# EAGLE design board (EAGLE 9.6.2)
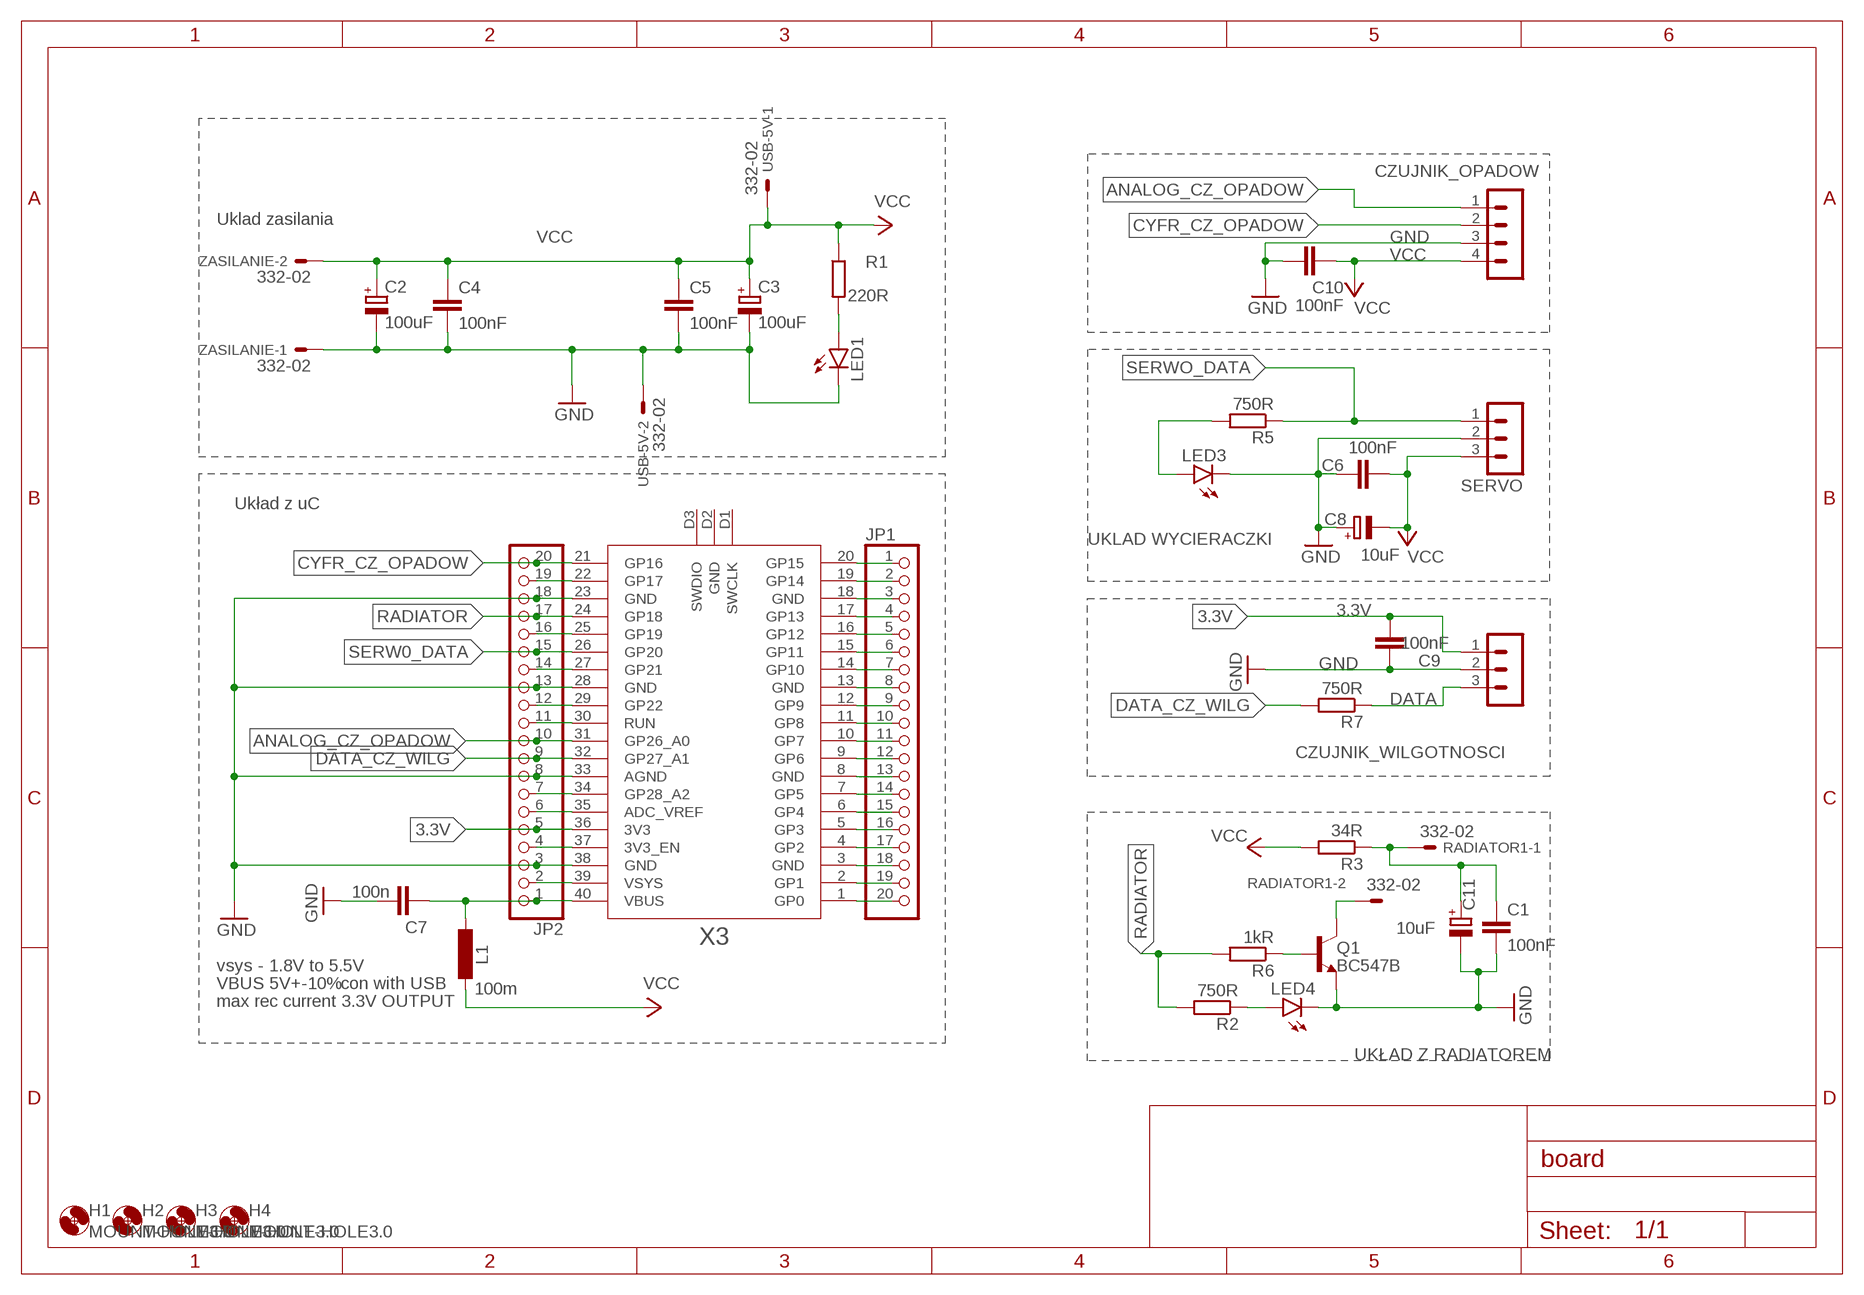
[diagram p0: schematic, sheet 1]

## Parts
C1  100nF  C-EUC0805  [C0805]
C2  100uF  CPOL-EUUD-5X5,8  [UD-5X5,8_NICHICON]
C3  100uF  CPOL-EUUD-5X5,8  [UD-5X5,8_NICHICON]
C4  100nF  C-EUC0805  [C0805]
C5  100nF  C-EUC0805  [C0805]
C6  100nF  C-EUC0805  [C0805]
C7  100n  C-EUC0603  [C0603]
C8  10uF  CPOL-EUE5-8.5  [E5-8,5]
C9  100nF  C-EUC0805  [C0805]
C10  100nF  C-EUC0805  [C0805]
C11  10uF  CPOL-EUE5-8.5  [E5-8,5]
CZUJNIK_OPADOW  MA04-1  [MA04-1]
CZUJNIK_WILGOTNOSCI  MA03-1  [MA03-1]
H1  MOUNT-HOLE3.0  [3,0]
H2  MOUNT-HOLE3.0  [3,0]
H3  MOUNT-HOLE3.0  [3,0]
H4  MOUNT-HOLE3.0  [3,0]
JP1  PINHD-1X20  [1X20]
JP2  PINHD-1X20  [1X20]
L1  100m  L-EUL2012C  [L2012C]
LED1  LEDSML0805  [SML0805]
LED3  LEDSML0805  [SML0805]
LED4  LEDSML0805  [SML0805]
Q1  BC547B  [TO92]
R1  220R  R-EU_R0805  [R0805]
R2  750R  R-EU_R0805  [R0805]
R3  34R  R-EU_R0805  [R0805]
R5  750R  R-EU_R0805  [R0805]
R6  1kR  R-EU_R0805  [R0805]
R7  750R  R-EU_R0805  [R0805]
RADIATOR1  332-02  [332-02]
SERVO  MA03-1  [MA03-1]
USB-5V  332-02  [332-02]
X3  RPI_PICO_IG-TH  [RPI_PICO_TH]
ZASILANIE  332-02  [332-02]

## Nets
3.3V: C9.2 CZUJNIK_WILGOTNOSCI.1 JP2.5 X3.36(3V3)
ANALOG_CZ_OPADOW: CZUJNIK_OPADOW.1 JP2.10 X3.31(GP26_A0)
CYFR_CZ_OPADOW: CZUJNIK_OPADOW.2 JP2.20 X3.21(GP16)
DATA: CZUJNIK_WILGOTNOSCI.3 R7.1
DATA_CZ_WILG: JP2.9 R7.2 X3.32(GP27_A1)
GND: C1.2 C2.- C3.- C4.2 C5.2 C6.1 C7.2 C8.+ C9.1 C10.2 C11.- CZUJNIK_OPADOW.3 CZUJNIK_WILGOTNOSCI.2 JP2.3 JP2.8 JP2.13 JP2.18 LED1.C LED3.C LED4.C Q1.1(E) SERVO.2 USB-5V.2 X3.23(GND) X3.28(GND) X3.33(AGND) X3.38(GND) ZASILANIE.1
N$1: JP2.19 X3.22(GP17)
N$2: LED1.A R1.2
N$3: Q1.3(C) RADIATOR1.2
N$4: Q1.2(B) R6.1
N$5: C7.1 JP2.1 L1.2 X3.40(VBUS)
N$6: LED4.A R2.1
N$7: JP2.16 X3.25(GP19)
N$8: LED3.A R5.2
N$9: R5.1 SERVO.1
N$10: JP1.1 X3.20(GP15)
N$11: JP2.14 X3.27(GP21)
N$12: JP2.12 X3.29(GP22)
N$13: JP2.11 X3.30(RUN)
N$14: JP2.7 X3.34(GP28_A2)
N$15: JP2.6 X3.35(ADC_VREF)
N$16: JP2.4 X3.37(3V3_EN)
N$18: JP1.20 X3.1(GP0)
N$19: JP1.19 X3.2(GP1)
N$20: JP1.18 X3.3(GND)
N$21: JP1.17 X3.4(GP2)
N$22: JP1.16 X3.5(GP3)
N$23: JP1.15 X3.6(GP4)
N$24: JP1.14 X3.7(GP5)
N$25: JP1.13 X3.8(GND)
N$26: JP1.12 X3.9(GP6)
N$27: JP1.11 X3.10(GP7)
N$28: JP1.10 X3.11(GP8)
N$29: JP1.9 X3.12(GP9)
N$30: JP1.8 X3.13(GND)
N$31: JP1.7 X3.14(GP10)
N$32: JP1.6 X3.15(GP11)
N$33: JP1.5 X3.16(GP12)
N$34: JP1.4 X3.17(GP13)
N$35: JP1.3 X3.18(GND)
N$36: JP1.2 X3.19(GP14)
N$37: JP2.2 X3.39(VSYS)
RADIATOR: JP2.17 R2.2 R6.2 X3.24(GP18)
SERW0_DATA: JP2.15 X3.26(GP20)
VCC: C2.+ C3.+ C4.1 C5.1 C6.2 C8.- C10.1 CZUJNIK_OPADOW.4 L1.1 R1.1 R3.2 SERVO.3 USB-5V.1 ZASILANIE.2
VCC1: C1.1 C11.+ R3.1 RADIATOR1.1
Unconnected: X3.D1(SWCLK) X3.D2(GND) X3.D3(SWDIO)

## Notes on the sheet
- Uklad zasilania
- Układ z uC
- UKLAD WYCIERACZKI
- vsys - 1.8V to 5.5V
- VBUS 5V+-10% | con with USB
- max rec current 3.3V OUTPUT
- UKŁAD Z RADIATOREM

## Library data of the parts
C1 C4-C7 C9 C10 = rcl:C-EU: CAPACITOR, European symbol; SPICEPREFIX: C
C2 C3 C8 C11 = rcl:CPOL-EU: POLARIZED CAPACITOR, European symbol; SPICEPREFIX: C
CZUJNIK_OPADOW = con-lstb:MA04-1: PIN HEADER; OC_FARNELL: unknown; OC_NEWARK: unknown
CZUJNIK_WILGOTNOSCI SERVO = con-lstb:MA03-1: PIN HEADER; OC_FARNELL: unknown; OC_NEWARK: unknown
H1-H4 = holes:MOUNT-HOLE: MOUNTING HOLE with drill center marker
JP1 JP2 = pinhead:PINHD-1X20: PIN HEADER
L1 = rcl:L-EU: INDUCTOR, European symbol; SPICEPREFIX: L
LED1 LED3 LED4 = led:LED: LED OSRAM: - CHIPLED LG R971, LG N971, LY N971, LG Q971, LY Q971, LO R971, LY R971 LH N974, LH R974 LS Q976, LO Q976, LY Q976 LO Q996 - Hyper CHIPLED LW Q18S LB Q993, LB Q99A, LB R99A - SideLED LS A670, LO A670, LY A670, LG A670, LP A670 LB A673, LV A673, LT A673, LW A673 LH A674 LY A675 LS A676, LA A676, LO A676, LY A676, LW A676 LS A679, LY A679, LG A679 - Hyper Micro SIDELED® LS Y876, LA Y876, LO Y876, LY Y876 LT Y87S - SmartLED LW L88C, LW L88S LB L89C, LB L89S, LG L890 LS L89K, LO L89K, LY L89K LS L896, LA L896, LO L896, LY L896 - TOPLED LS T670, LO T670, LY T670, LG T670, LP T670 LSG T670, LSP T670, LSY T670, LOP T670, LYG T670 LG T671, LOG T671, LSG T671 LB T673, LV T673, LT T673, LW T673 LH T674 LS T676, LA T676, LO T676, LY T676, LB T676, LH T676, LSB T676, LW T676 LB T67C, LV T67C, LT T67C, LS T67K, LO T67K, LY T67K, LW E67C LS E67B, LA E67B, LO E67B, LY E67B, LB E67C, LV E67C, LT E67C LW T67C LS T679, LY T679, LG T679 LS T770, LO T770, LY T770, LG T770, LP T770 LB T773, LV T773, LT T773, LW T773 LH T774 LS E675, LA E675, LY E675, LS T675 LS T776, LA T776, LO T776, LY T776, LB T776 LHGB T686 LT T68C, LB T68C - Hyper Mini TOPLED® LB M676 - Mini TOPLED Santana® LG M470 LS M47K, LO M47K, LY M47K Source: http://www.osram.convergy.de LUXEON: - LUMILED® LXK2-PW12-R00, LXK2-PW12-S00, LXK2-PW14-U00, LXK2-PW14-V00 LXK2-PM12-R00, LXK2-PM12-S00, LXK2-PM14-U00 LXK2-PE12-Q00, LXK2-PE12-R00, LXK2-PE12-S00, LXK2-PE14-T00, LXK2-PE14-U00 LXK2-PB12-K00, LXK2-PB12-L00, LXK2-PB12-M00, LXK2-PB14-N00, LXK2-PB14-P00, LXK2-PB14-Q00 LXK2-PR12-L00, LXK2-PR12-M00, LXK2-PR14-Q00, LXK2-PR14-R00 LXK2-PD12-Q00, LXK2-PD12-R00, LXK2-PD12-S00 LXK2-PH12-R00, LXK2-PH12-S00 LXK2-PL12-P00, LXK2-PL12-Q00, LXK2-PL12-R00 Source: www.luxeon.com KINGBRIGHT: KA-3528ASYC Source: www.kingbright.com
Q1 = transistor-npn:BC547*: NPN Transistor
R1-R3 R5-R7 = rcl:R-EU_: RESISTOR, European symbol; SPICEPREFIX: R
RADIATOR1 USB-5V ZASILANIE = con-garry:332-02: 2 Pin - 2mm Dual Row Source: www.mpe-connector.de / garry_shortform_2012.pdf
X3 = RaspberryPi_Pico-corr:RPI_PICO_IG

## Board
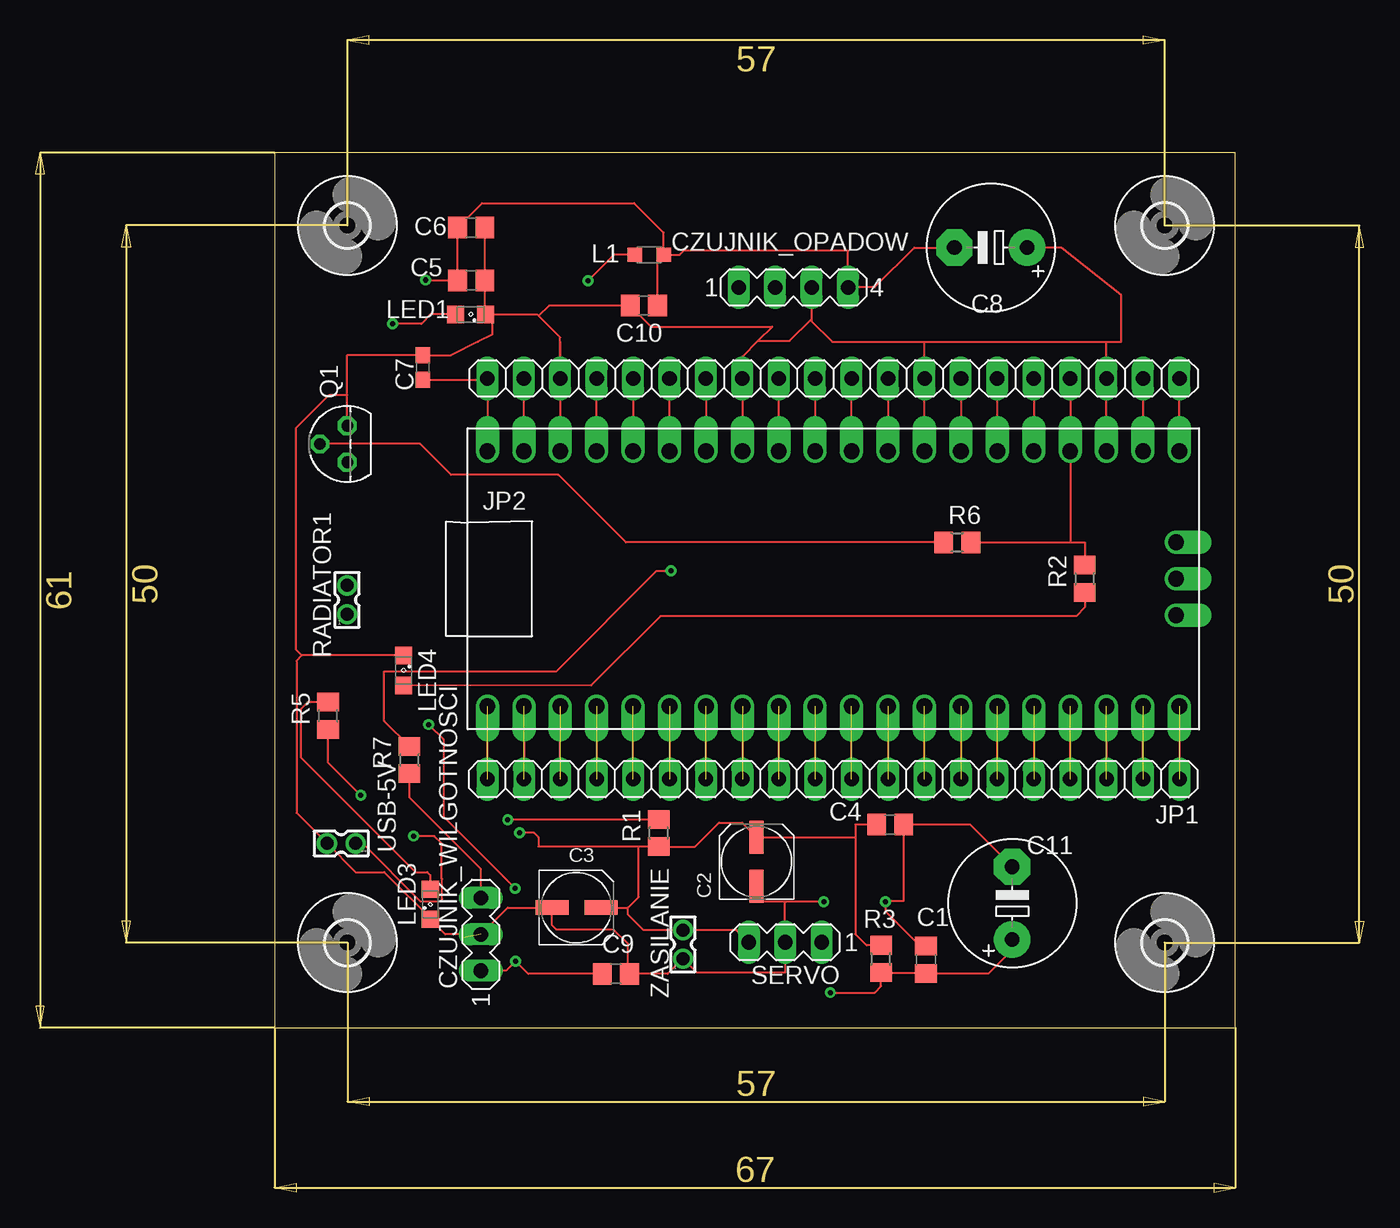
[diagram p1: board, top side]
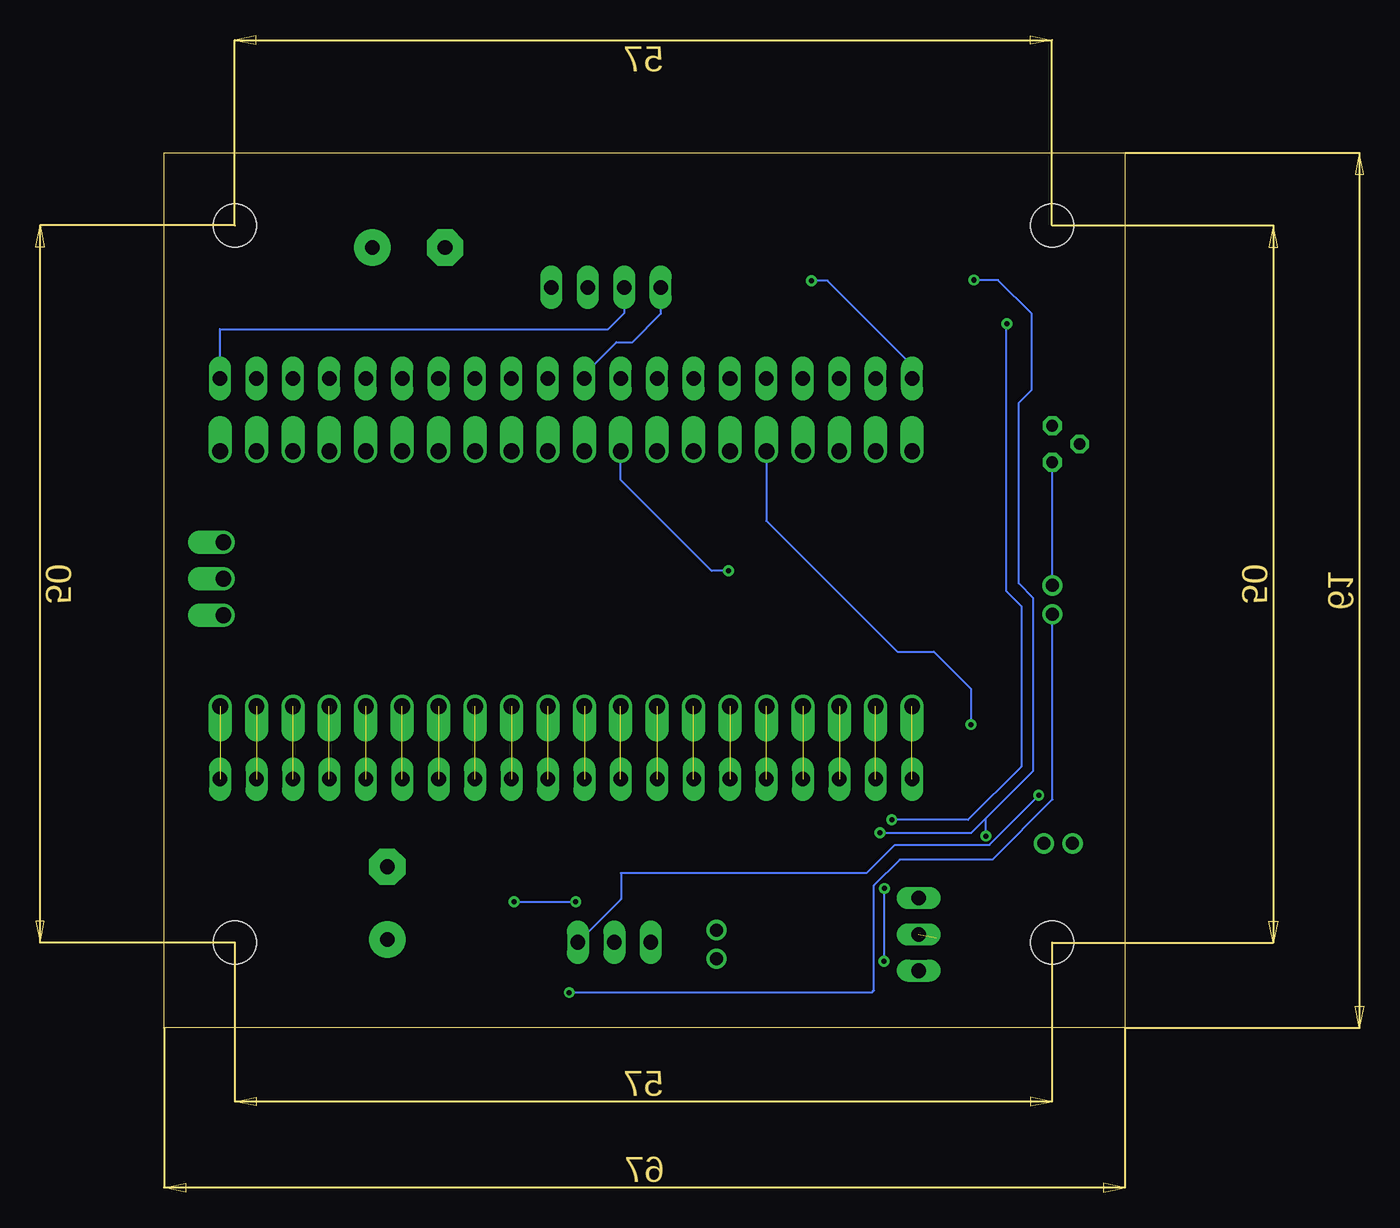
[diagram p2: board, bottom side, seen from below]

Size 67 x 61 mm. Coordinates in mm from the lower left corner, seen from the top.
Outline: 0,0 67,0 67,61 0,61 0,0
Copper layers (1*16): Top 0.035mm / dielectric 1.5mm / Bottom 0.035mm
Design rules "default": minimum track width 6mil, minimum drill 0.35mm, track to track 6mil, track to pad 6mil, pad to pad 6mil, via to via 6mil, smd to smd 6mil, copper to edge 40mil, drill to drill 6mil, minimum pad ring 10mil, minimum via ring 8mil, stop-mask expansion 4mil, vias tented up to drill 0mil, thermal gap 10mil

### Footprints (pad centres in the part's own frame; a part is rotated, then mirrored left to right if it is on the bottom)
C0805 = smd 1.3 x 1.5: 1 -0.95,0; 2 0.95,0
UD-5X5,8_NICHICON = smd 2.3 x 1: + 1.725,0; - -1.7,0
C0603 = smd 1.1 x 1: 1 -0.85,0; 2 0.85,0
E5-8,5 = drill 1.016 pad 2.54: + -2.54,0 | drill 1.016 pad 2.54 octagon: - 2.54,0
MA04-1 = drill 1.016 long: 1 -3.81,0; 2 -1.27,0; 3 1.27,0; 4 3.81,0
MA03-1 = drill 1.016 long: 1 -2.54,0; 2 0,0; 3 2.54,0
3,0 = hole 3: 0,0
1X20 = drill 1.016 long: 1 -24.13,0; 2 -21.59,0; 3 -19.05,0; 4 -16.51,0; 5 -13.97,0; 6 -11.43,0; 7 -8.89,0; 8 -6.35,0; 9 -3.81,0; 10 -1.27,0; 11 1.27,0; 12 3.81,0; 13 6.35,0; 14 8.89,0; 15 11.43,0; 16 13.97,0; 17 16.51,0; 18 19.05,0; 19 21.59,0; 20 24.13,0
L2012C = smd 1 x 1: 1 -1,0; 2 1,0
SML0805 = smd 1.2 x 1.2: A 1.05,0; C -1.05,0
TO92 = drill 0.813 octagon: 1 1.27,0; 2 0,1.905; 3 -1.27,0
R0805 = smd 1.3 x 1.5: 1 -0.95,0; 2 0.95,0
332-02 = drill 0.9 pad 1.27: 1 0,-1; 2 0,1
RPI_PICO_TH = drill 1.1 pad 1.6 offset: 1 -8.89,24.13; 2 -8.89,21.59; 3 -8.89,19.05; 4 -8.89,16.51; 5 -8.89,13.97; 6 -8.89,11.43; 7 -8.89,8.89; 8 -8.89,6.35; 9 -8.89,3.81; 10 -8.89,1.27; 11 -8.89,-1.27; 12 -8.89,-3.81; 13 -8.89,-6.35; 14 -8.89,-8.89; 15 -8.89,-11.43; 16 -8.89,-13.97; 17 -8.89,-16.51; 18 -8.89,-19.05; 19 -8.89,-21.59; 20 -8.89,-24.13; 21 8.89,-24.13; 22 8.89,-21.59; 23 8.89,-19.05; 24 8.89,-16.51; 25 8.89,-13.97; 26 8.89,-11.43; 27 8.89,-8.89; 28 8.89,-6.35; 29 8.89,-3.81; 30 8.89,-1.27; 31 8.89,1.27; 32 8.89,3.81; 33 8.89,6.35; 34 8.89,8.89; 35 8.89,11.43; 36 8.89,13.97; 37 8.89,16.51; 38 8.89,19.05; 39 8.89,21.59; 40 8.89,24.13; D1 -2.54,-23.9; D2 0,-23.9; D3 2.54,-23.9

### Placement (x,y rotation side)
C1  45.42,4.74 90 top
C2  33.61,11.57 90 top
C3  21.04,8.37 0 top
C4  42.93,14.16 0 top
C5  13.72,52.11 0 top
C6  13.71,55.78 180 top
C7  10.34,46.04 90 top
C8  49.95,54.39 180 top
C9  23.81,3.75 180 top
C10  25.75,50.35 180 top
C11  51.45,8.69 90 top
CZUJNIK_OPADOW  36.18,51.62 0 top
CZUJNIK_WILGOTNOSCI  14.39,6.52 90 top
H1  5.08,5.93 0 top
H2  62.08,55.93 0 top
H3  5.08,55.93 0 top
H4  62.08,5.93 0 top
JP1  38.97,17.33 180 top
JP2  38.97,45.27 0 top
L1  26.13,53.89 180 top
LED1  13.67,49.73 180 top
LED3  10.86,8.61 90 top
LED4  9.01,24.91 270 top
Q1  5.06,40.7 90 top
R1  26.79,13.58 90 top
R2  56.5,31.3 90 top
R3  42.29,4.8 90 top
R5  3.73,21.75 90 top
R6  47.61,33.84 0 top
R7  9.41,18.67 90 top
RADIATOR1  5.05,29.84 0 top
SERVO  35.61,5.96 180 top
USB-5V  4.65,12.85 90 top
X3  38.97,31.3 90 top
ZASILANIE  28.47,5.81 0 top

### Tracks (layer width: path | path; a pad name or v marks a point on that pad's centre or on a via)
3.3V  (via drill 0.35)
  Top 0.152: JP2.5 X3.36 | v10.75,21.14 11.78,20.11 11.78,14.71 v16.78,9.71 | 22.86,3.96 C9.2 17.68,3.75 v16.8,4.64 | v16.81,4.63 v16.8,4.64 | v16.8,4.64 16.13,3.97 CZUJNIK_WILGOTNOSCI.1
  Bottom 0.152: X3.36 25,35.34 15.88,26.22 13.32,26.22 10.75,23.65 v10.75,21.14 | v16.78,9.71 16.8,9.69 v16.8,4.64
ANALOG_CZ_OPADOW
  Top 0.152: JP2.10 X3.31
  Bottom 0.152: CZUJNIK_OPADOW.1 32.37,49.76 34.34,47.8 35.46,47.8 37.7,45.55 JP2.10
CYFR_CZ_OPADOW
  Top 0.152: X3.21 JP2.20
  Bottom 0.152: JP2.20 63.1,48.7 36.04,48.7 34.91,49.83 CZUJNIK_OPADOW.2
DATA
  Top 0.152: CZUJNIK_WILGOTNOSCI.3 14.39,11.05 9.41,16.04 R7.1
DATA_CZ_WILG  (via drill 0.35)
  Top 0.152: X3.32 JP2.9 | R7.2 7.65,21.38 7.65,24.85 19.65,24.85 26.65,31.85 v27.65,31.85
  Bottom 0.152: v27.65,31.85 28.82,31.85 35.16,38.19 X3.32
GND  (via drill 0.35)  (1 unrouted)
  Top 0.152: C2.- 33.61,8.78 35.65,8.78 | X3.23 JP2.18 58.02,47.81 | X3.28 JP2.13 45.32,47.81 | X3.33 JP2.8 32.62,46.79 33.71,47.88 | JP2.3 X3.38 | v38.3,8.78 35.65,8.78 | C8.+ 54.87,54.39 59.04,51.05 59.04,47.81 58.02,47.81 | 45.32,47.81 38.9,47.81 37.45,49.26 CZUJNIK_OPADOW.3 37.45,49.41 35.92,47.88 33.71,47.88 | 45.32,47.81 58.02,47.81 | 33.71,47.88 34.71,48.88 26.27,48.88 C10.2 19.15,50.35 18.42,49.62 | JP2.3 19.92,48.12 18.42,49.62 | 14.17,47.82 15.17,48.32 15.17,49.27 LED1.C | 14.17,47.82 12.3,46.88 C7.2 5.06,46.88 5.06,44.13 | 19.92,47.81 JP2.3 | 14.17,47.82 14.17,47.81 | Q1.1 5.06,44.13 | C3.- 19.33,8.39 | 5.06,44.13 3.79,44.13 1.51,41.84 1.51,26.35 1.9,25.96 | C11.- 48.51,14.16 C4.2 43.88,8.85 42.68,8.85 v42.61,8.78 42.61,8.12 45.04,5.69 C1.2 | LED1.C 14.67,49.78 C5.2 C6.1 | LED4.C 1.9,25.96 | LED3.C 11.11,7.31 | 11.11,7.31 11.91,6.51 CZUJNIK_WILGOTNOSCI.2 16.25,8.37 C3.- | C3.- 19.34,7.16 19.65,6.85 23.65,6.85 24.65,5.85 24.65,3.86 C9.1 27.42,3.75 ZASILANIE.1 29.44,3.84 35.61,3.84 SERVO.2 35.61,8.74 35.65,8.78 | 13.15,6.28 13.15,6.35 | 1.9,25.96 1.53,25.58 1.53,14.97 USB-5V.2 5.65,10.85 7.65,10.85 11.11,7.39 11.11,7.31 | LED1.C 18.32,49.73 18.42,49.62
  Bottom 0.152: v42.61,8.78 v38.3,8.78
N$1
  Top 0.152: JP2.19 X3.22
N$2  (via drill 0.35)
  Top 0.152: LED1.A 10.89,49.73 10.24,49.08 v8.24,49.08 | R1.2 26.75,14.49 v16.26,14.49
  Bottom 0.152: v8.24,49.08 8.29,49.02 8.29,30.47 7.23,29.4 7.23,18.21 10.95,14.49 v16.26,14.49
N$3
  Bottom 0.152: Q1.3 5.05,39.42 RADIATOR1.2
N$4
  Top 0.152: R6.1 24.5,33.84 19.8,38.54 12.3,38.54 10.15,40.7 Q1.2
N$5  (via drill 0.35)
  Top 0.152: X3.40 JP2.1 14.76,45.19 C7.1 | L1.2 23.67,53.89 v21.86,52.08
  Bottom 0.152: JP2.1 14.84,46.19 20.73,52.08 v21.86,52.08
N$6
  Top 0.152: R2.1 56.5,29.3 55.9,28.7 26.91,28.7 22.08,23.87 LED4.A
N$7
  Top 0.152: JP2.16 X3.25
N$8
  Top 0.152: R5.2 3.71,22.73 2.34,22.73 1.83,22.22 1.83,18.85 9.83,10.85 10.65,10.85 10.86,10.64 LED3.A
N$9  (via drill 0.35)
  Top 0.152: v6.01,16.21 v6.01,16.2 3.73,18.48 R5.1
  Bottom 0.152: v6.01,16.2 v6.01,16.19 9.45,12.76 16.04,12.76 18.02,10.78 35.15,10.78 35.15,8.96 SERVO.1
N$10  (1 unrouted)
  Top 0.152: X3.20 JP1.1
N$11
  Top 0.152: JP2.14 X3.27
N$12
  Top 0.152: JP2.12 X3.29
N$13
  Top 0.152: X3.30 JP2.11
N$14
  Top 0.152: JP2.7 X3.34
N$15
  Top 0.152: X3.35 JP2.6
N$16
  Top 0.152: X3.37 JP2.4
N$18  (1 unrouted)
  Top 0.152: JP1.20 X3.1
N$19  (1 unrouted)
  Top 0.152: X3.2 JP1.19
N$20  (1 unrouted)
  Top 0.152: JP1.18 X3.3
N$21  (1 unrouted)
  Top 0.152: X3.4 JP1.17
N$22  (1 unrouted)
  Top 0.152: JP1.16 X3.5
N$23  (1 unrouted)
  Top 0.152: X3.6 JP1.15
N$24  (1 unrouted)
  Top 0.152: JP1.14 X3.7
N$25  (1 unrouted)
  Top 0.152: X3.8 JP1.13
N$26  (1 unrouted)
  Top 0.152: JP1.12 X3.9
N$27  (1 unrouted)
  Top 0.152: X3.10 JP1.11
N$28  (1 unrouted)
  Top 0.152: JP1.10 X3.11
N$29  (1 unrouted)
  Top 0.152: X3.12 JP1.9
N$30  (1 unrouted)
  Top 0.152: JP1.8 X3.13
N$31  (1 unrouted)
  Top 0.152: X3.14 JP1.7
N$32  (1 unrouted)
  Top 0.152: JP1.6 X3.15
N$33  (1 unrouted)
  Top 0.152: X3.16 JP1.5
N$34  (1 unrouted)
  Top 0.152: JP1.4 X3.17
N$35  (1 unrouted)
  Top 0.152: X3.18 JP1.3
N$36  (1 unrouted)
  Top 0.152: JP1.2 X3.19
N$37
  Top 0.152: X3.39 JP2.2
RADIATOR
  Top 0.152: JP2.17 X3.24 55.48,33.84 | R2.2 56.5,33.84 55.48,33.84 | R6.2 55.48,33.84
SERW0_DATA
  Top 0.152: X3.26 JP2.15
VCC  (via drill 0.35)
  Top 0.152: 41.97,14.17 C4.1 41.66,14.16 | 41.97,14.17 41.79,14.36 | C2.+ | L1.1 28.24,53.89 28.51,54.16 39.99,54.16 CZUJNIK_OPADOW.4 41.84,51.62 44.61,54.39 C8.- | 25.39,12.63 25.39,9.12 24.64,8.37 | v17.08,13.59 18.08,13.59 18.39,13.28 18.39,12.63 25.39,12.63 | 25.39,12.63 R1.1 29.33,12.63 31,14.3 32.61,14.3 C2.+ | C2.+ 40.49,13.3 | 33.05,5.96 SERVO.3 32.22,6.81 ZASILANIE.2 25.72,6.81 24.64,7.89 24.64,8.37 | 40.49,13.3 40.49,14.19 40.51,14.17 41.97,14.17 | 40.49,13.3 40.49,6.53 41.28,5.75 R3.2 | v10.53,52.13 12.74,52.13 C5.1 C6.2 14.47,57.49 25.07,57.49 27.13,55.43 L1.1 | C10.1 26.7,53.46 L1.1 | C3.+ 24.63,8.37 24.64,8.37 | USB-5V.1 6.15,12.85 10.16,8.83 11.55,8.83 11.57,8.85 11.65,8.85 11.65,8.93 11.69,8.97 11.69,10.36 11.65,10.4 11.65,12.85 11.13,13.37 v9.7,13.37
  Bottom 0.152: 9.7,14.6 10.71,13.59 v17.08,13.59 | 9.7,14.6 6.39,17.91 6.39,29.96 7.4,30.97 7.4,43.57 6.5,44.47 6.5,49.79 8.84,52.13 v10.53,52.13 | v9.7,13.37 9.7,14.6
VCC1  (via drill 0.35)
  Top 0.152: v38.75,2.46 41.85,2.46 42.3,2.91 42.3,3.84 R3.1 45.36,3.85 C1.1 49.8,3.79 51.45,5.44 C11.+
  Bottom 0.152: v38.75,2.46 17.65,2.46 17.49,2.61 17.49,9.93 15.7,11.73 9.25,11.73 5.05,15.92 RADIATOR1.1